# EAGLE design minionRVB (EAGLE 7.2.0)
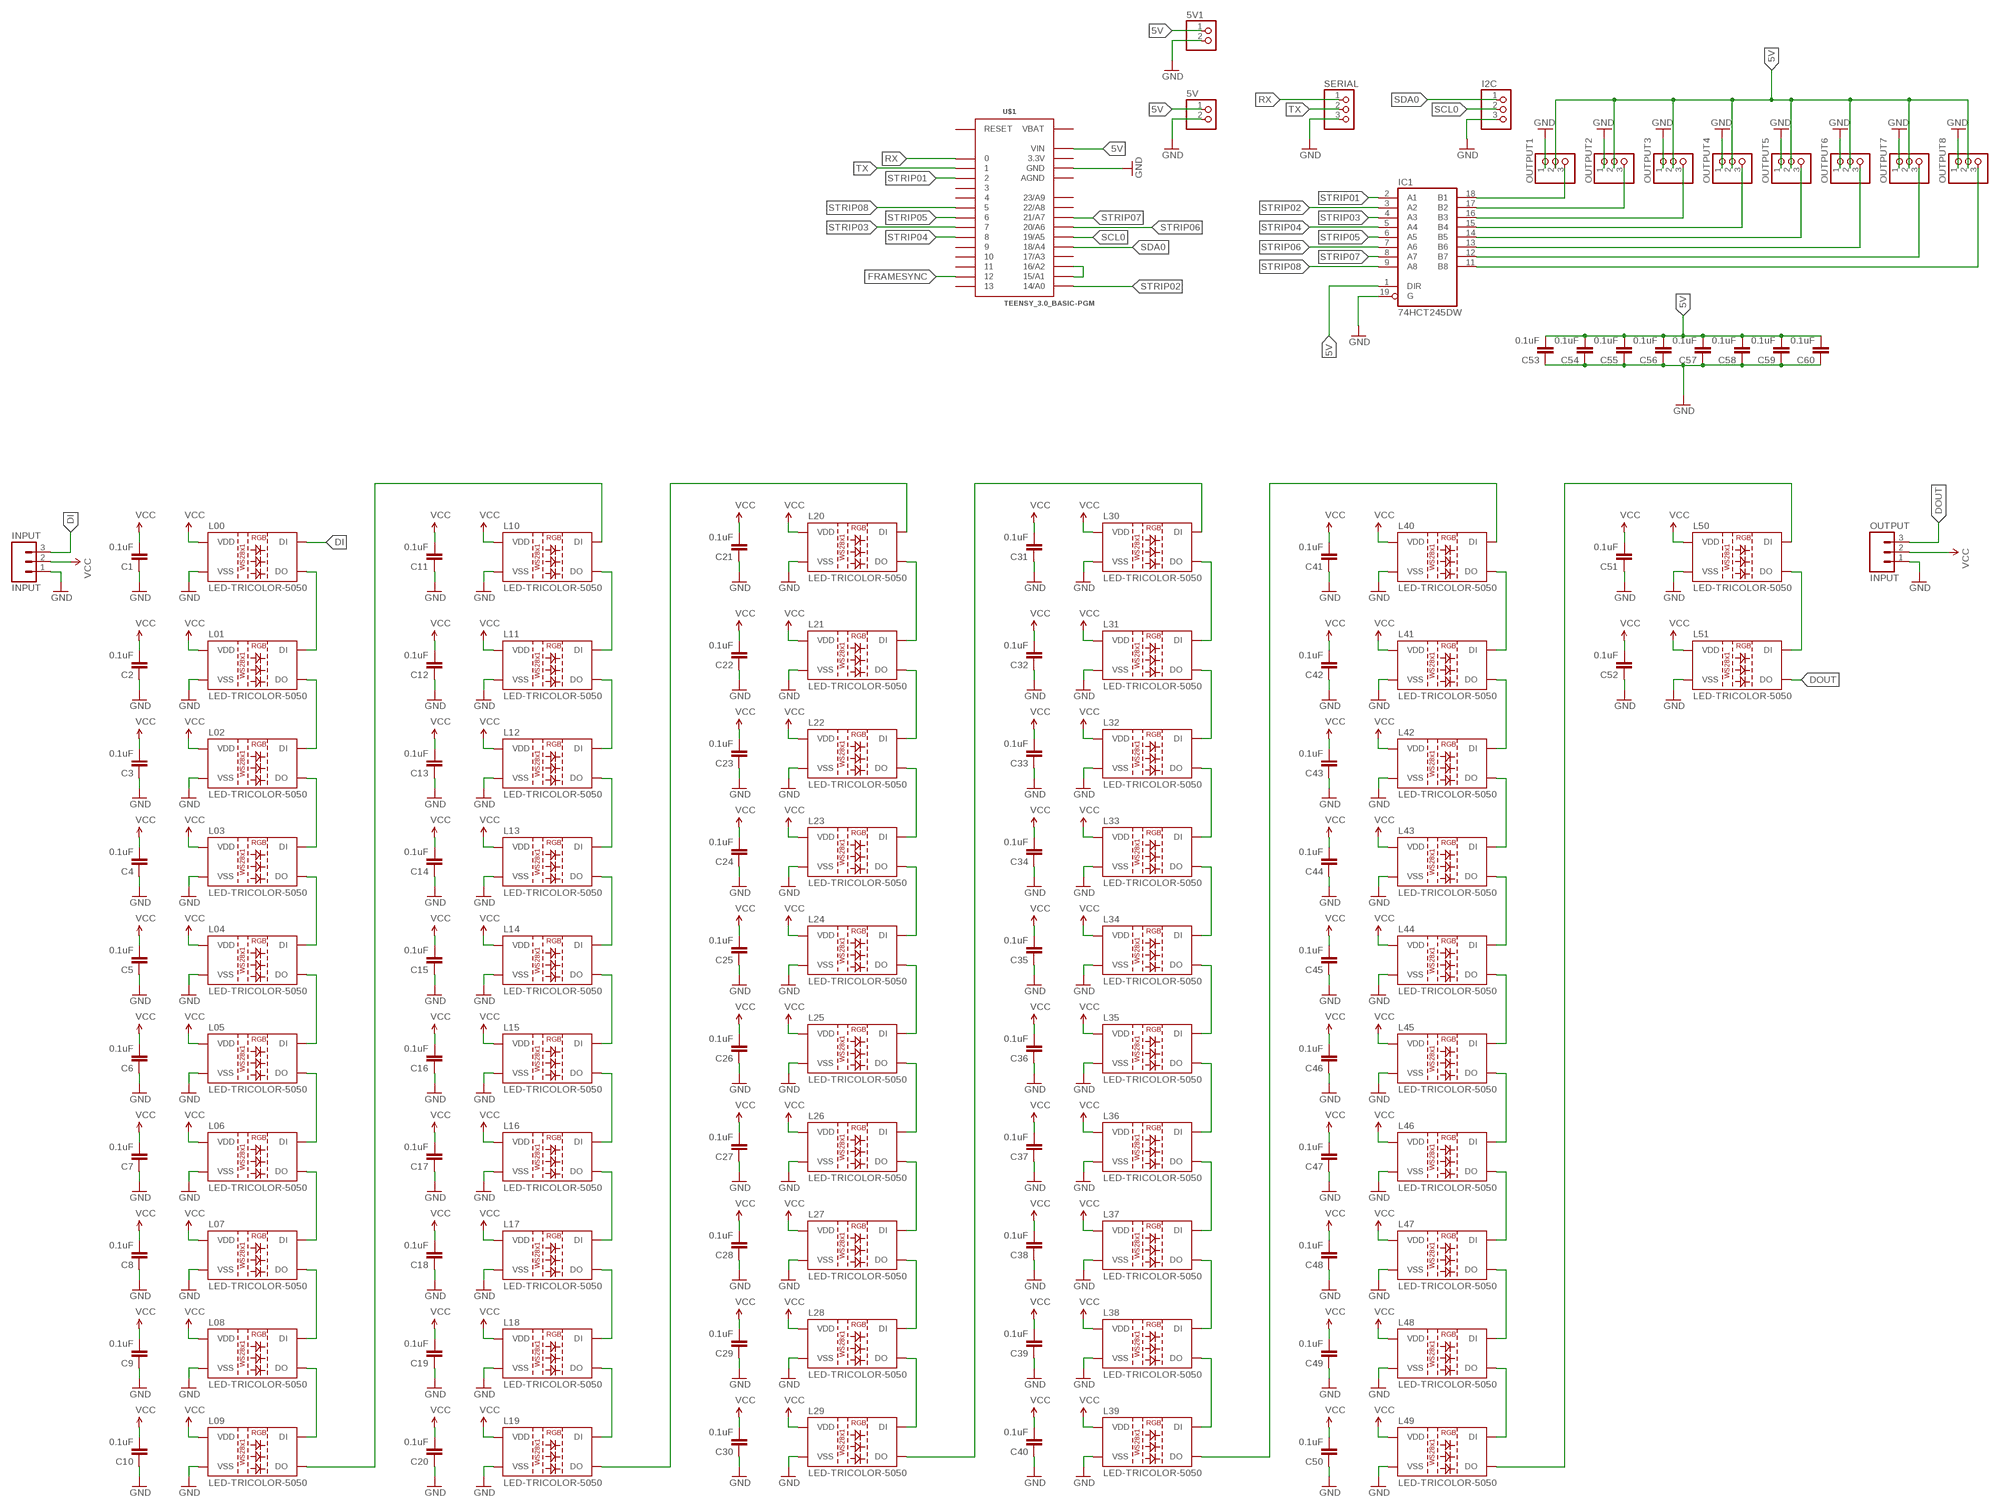
[diagram p0: schematic, sheet 1]

## Parts
5V  PINHD-1X2  [1X02]
5V1  PINHD-1X2  [1X02]
C1  0.1uF  CAP0603-CAP  [0603-CAP]
C2  0.1uF  CAP0603-CAP  [0603-CAP]
C3  0.1uF  CAP0603-CAP  [0603-CAP]
C4  0.1uF  CAP0603-CAP  [0603-CAP]
C5  0.1uF  CAP0603-CAP  [0603-CAP]
C6  0.1uF  CAP0603-CAP  [0603-CAP]
C7  0.1uF  CAP0603-CAP  [0603-CAP]
C8  0.1uF  CAP0603-CAP  [0603-CAP]
C9  0.1uF  CAP0603-CAP  [0603-CAP]
C10  0.1uF  CAP0603-CAP  [0603-CAP]
C11  0.1uF  CAP0603-CAP  [0603-CAP]
C12  0.1uF  CAP0603-CAP  [0603-CAP]
C13  0.1uF  CAP0603-CAP  [0603-CAP]
C14  0.1uF  CAP0603-CAP  [0603-CAP]
C15  0.1uF  CAP0603-CAP  [0603-CAP]
C16  0.1uF  CAP0603-CAP  [0603-CAP]
C17  0.1uF  CAP0603-CAP  [0603-CAP]
C18  0.1uF  CAP0603-CAP  [0603-CAP]
C19  0.1uF  CAP0603-CAP  [0603-CAP]
C20  0.1uF  CAP0603-CAP  [0603-CAP]
C21  0.1uF  CAP0603-CAP  [0603-CAP]
C22  0.1uF  CAP0603-CAP  [0603-CAP]
C23  0.1uF  CAP0603-CAP  [0603-CAP]
C24  0.1uF  CAP0603-CAP  [0603-CAP]
C25  0.1uF  CAP0603-CAP  [0603-CAP]
C26  0.1uF  CAP0603-CAP  [0603-CAP]
C27  0.1uF  CAP0603-CAP  [0603-CAP]
C28  0.1uF  CAP0603-CAP  [0603-CAP]
C29  0.1uF  CAP0603-CAP  [0603-CAP]
C30  0.1uF  CAP0603-CAP  [0603-CAP]
C31  0.1uF  CAP0603-CAP  [0603-CAP]
C32  0.1uF  CAP0603-CAP  [0603-CAP]
C33  0.1uF  CAP0603-CAP  [0603-CAP]
C34  0.1uF  CAP0603-CAP  [0603-CAP]
C35  0.1uF  CAP0603-CAP  [0603-CAP]
C36  0.1uF  CAP0603-CAP  [0603-CAP]
C37  0.1uF  CAP0603-CAP  [0603-CAP]
C38  0.1uF  CAP0603-CAP  [0603-CAP]
C39  0.1uF  CAP0603-CAP  [0603-CAP]
C40  0.1uF  CAP0603-CAP  [0603-CAP]
C41  0.1uF  CAP0603-CAP  [0603-CAP]
C42  0.1uF  CAP0603-CAP  [0603-CAP]
C43  0.1uF  CAP0603-CAP  [0603-CAP]
C44  0.1uF  CAP0603-CAP  [0603-CAP]
C45  0.1uF  CAP0603-CAP  [0603-CAP]
C46  0.1uF  CAP0603-CAP  [0603-CAP]
C47  0.1uF  CAP0603-CAP  [0603-CAP]
C48  0.1uF  CAP0603-CAP  [0603-CAP]
C49  0.1uF  CAP0603-CAP  [0603-CAP]
C50  0.1uF  CAP0603-CAP  [0603-CAP]
C51  0.1uF  CAP0603-CAP  [0603-CAP]
C52  0.1uF  CAP0603-CAP  [0603-CAP]
C53  0.1uF  CAP0603-CAP  [0603-CAP]
C54  0.1uF  CAP0603-CAP  [0603-CAP]
C55  0.1uF  CAP0603-CAP  [0603-CAP]
C56  0.1uF  CAP0603-CAP  [0603-CAP]
C57  0.1uF  CAP0603-CAP  [0603-CAP]
C58  0.1uF  CAP0603-CAP  [0603-CAP]
C59  0.1uF  CAP0603-CAP  [0603-CAP]
C60  0.1uF  CAP0603-CAP  [0603-CAP]
I2C  PINHD-1X3  [1X03]
IC1  74HCT245DW  [SO20W]
INPUT  INPUT  M03PTH  [1X03]
L00  LED-TRICOLOR-5050  LED-TRICOLOR-5050-ICWS2811  [LED-TRICOLOR-5050-IC]
L01  LED-TRICOLOR-5050  LED-TRICOLOR-5050-ICWS2811  [LED-TRICOLOR-5050-IC]
L02  LED-TRICOLOR-5050  LED-TRICOLOR-5050-ICWS2811  [LED-TRICOLOR-5050-IC]
L03  LED-TRICOLOR-5050  LED-TRICOLOR-5050-ICWS2811  [LED-TRICOLOR-5050-IC]
L04  LED-TRICOLOR-5050  LED-TRICOLOR-5050-ICWS2811  [LED-TRICOLOR-5050-IC]
L05  LED-TRICOLOR-5050  LED-TRICOLOR-5050-ICWS2811  [LED-TRICOLOR-5050-IC]
L06  LED-TRICOLOR-5050  LED-TRICOLOR-5050-ICWS2811  [LED-TRICOLOR-5050-IC]
L07  LED-TRICOLOR-5050  LED-TRICOLOR-5050-ICWS2811  [LED-TRICOLOR-5050-IC]
L08  LED-TRICOLOR-5050  LED-TRICOLOR-5050-ICWS2811  [LED-TRICOLOR-5050-IC]
L09  LED-TRICOLOR-5050  LED-TRICOLOR-5050-ICWS2811  [LED-TRICOLOR-5050-IC]
L10  LED-TRICOLOR-5050  LED-TRICOLOR-5050-ICWS2811  [LED-TRICOLOR-5050-IC]
L11  LED-TRICOLOR-5050  LED-TRICOLOR-5050-ICWS2811  [LED-TRICOLOR-5050-IC]
L12  LED-TRICOLOR-5050  LED-TRICOLOR-5050-ICWS2811  [LED-TRICOLOR-5050-IC]
L13  LED-TRICOLOR-5050  LED-TRICOLOR-5050-ICWS2811  [LED-TRICOLOR-5050-IC]
L14  LED-TRICOLOR-5050  LED-TRICOLOR-5050-ICWS2811  [LED-TRICOLOR-5050-IC]
L15  LED-TRICOLOR-5050  LED-TRICOLOR-5050-ICWS2811  [LED-TRICOLOR-5050-IC]
L16  LED-TRICOLOR-5050  LED-TRICOLOR-5050-ICWS2811  [LED-TRICOLOR-5050-IC]
L17  LED-TRICOLOR-5050  LED-TRICOLOR-5050-ICWS2811  [LED-TRICOLOR-5050-IC]
L18  LED-TRICOLOR-5050  LED-TRICOLOR-5050-ICWS2811  [LED-TRICOLOR-5050-IC]
L19  LED-TRICOLOR-5050  LED-TRICOLOR-5050-ICWS2811  [LED-TRICOLOR-5050-IC]
L20  LED-TRICOLOR-5050  LED-TRICOLOR-5050-ICWS2811  [LED-TRICOLOR-5050-IC]
L21  LED-TRICOLOR-5050  LED-TRICOLOR-5050-ICWS2811  [LED-TRICOLOR-5050-IC]
L22  LED-TRICOLOR-5050  LED-TRICOLOR-5050-ICWS2811  [LED-TRICOLOR-5050-IC]
L23  LED-TRICOLOR-5050  LED-TRICOLOR-5050-ICWS2811  [LED-TRICOLOR-5050-IC]
L24  LED-TRICOLOR-5050  LED-TRICOLOR-5050-ICWS2811  [LED-TRICOLOR-5050-IC]
L25  LED-TRICOLOR-5050  LED-TRICOLOR-5050-ICWS2811  [LED-TRICOLOR-5050-IC]
L26  LED-TRICOLOR-5050  LED-TRICOLOR-5050-ICWS2811  [LED-TRICOLOR-5050-IC]
L27  LED-TRICOLOR-5050  LED-TRICOLOR-5050-ICWS2811  [LED-TRICOLOR-5050-IC]
L28  LED-TRICOLOR-5050  LED-TRICOLOR-5050-ICWS2811  [LED-TRICOLOR-5050-IC]
L29  LED-TRICOLOR-5050  LED-TRICOLOR-5050-ICWS2811  [LED-TRICOLOR-5050-IC]
L30  LED-TRICOLOR-5050  LED-TRICOLOR-5050-ICWS2811  [LED-TRICOLOR-5050-IC]
L31  LED-TRICOLOR-5050  LED-TRICOLOR-5050-ICWS2811  [LED-TRICOLOR-5050-IC]
L32  LED-TRICOLOR-5050  LED-TRICOLOR-5050-ICWS2811  [LED-TRICOLOR-5050-IC]
L33  LED-TRICOLOR-5050  LED-TRICOLOR-5050-ICWS2811  [LED-TRICOLOR-5050-IC]
L34  LED-TRICOLOR-5050  LED-TRICOLOR-5050-ICWS2811  [LED-TRICOLOR-5050-IC]
L35  LED-TRICOLOR-5050  LED-TRICOLOR-5050-ICWS2811  [LED-TRICOLOR-5050-IC]
L36  LED-TRICOLOR-5050  LED-TRICOLOR-5050-ICWS2811  [LED-TRICOLOR-5050-IC]
L37  LED-TRICOLOR-5050  LED-TRICOLOR-5050-ICWS2811  [LED-TRICOLOR-5050-IC]
L38  LED-TRICOLOR-5050  LED-TRICOLOR-5050-ICWS2811  [LED-TRICOLOR-5050-IC]
L39  LED-TRICOLOR-5050  LED-TRICOLOR-5050-ICWS2811  [LED-TRICOLOR-5050-IC]
L40  LED-TRICOLOR-5050  LED-TRICOLOR-5050-ICWS2811  [LED-TRICOLOR-5050-IC]
L41  LED-TRICOLOR-5050  LED-TRICOLOR-5050-ICWS2811  [LED-TRICOLOR-5050-IC]
L42  LED-TRICOLOR-5050  LED-TRICOLOR-5050-ICWS2811  [LED-TRICOLOR-5050-IC]
L43  LED-TRICOLOR-5050  LED-TRICOLOR-5050-ICWS2811  [LED-TRICOLOR-5050-IC]
L44  LED-TRICOLOR-5050  LED-TRICOLOR-5050-ICWS2811  [LED-TRICOLOR-5050-IC]
L45  LED-TRICOLOR-5050  LED-TRICOLOR-5050-ICWS2811  [LED-TRICOLOR-5050-IC]
L46  LED-TRICOLOR-5050  LED-TRICOLOR-5050-ICWS2811  [LED-TRICOLOR-5050-IC]
L47  LED-TRICOLOR-5050  LED-TRICOLOR-5050-ICWS2811  [LED-TRICOLOR-5050-IC]
L48  LED-TRICOLOR-5050  LED-TRICOLOR-5050-ICWS2811  [LED-TRICOLOR-5050-IC]
L49  LED-TRICOLOR-5050  LED-TRICOLOR-5050-ICWS2811  [LED-TRICOLOR-5050-IC]
L50  LED-TRICOLOR-5050  LED-TRICOLOR-5050-ICWS2811  [LED-TRICOLOR-5050-IC]
L51  LED-TRICOLOR-5050  LED-TRICOLOR-5050-ICWS2811  [LED-TRICOLOR-5050-IC]
OUTPUT  INPUT  M03PTH  [1X03]
OUTPUT1  PINHD-1X3  [1X03]
OUTPUT2  PINHD-1X3  [1X03]
OUTPUT3  PINHD-1X3  [1X03]
OUTPUT4  PINHD-1X3  [1X03]
OUTPUT5  PINHD-1X3  [1X03]
OUTPUT6  PINHD-1X3  [1X03]
OUTPUT7  PINHD-1X3  [1X03]
OUTPUT8  PINHD-1X3  [1X03]
SERIAL  PINHD-1X3  [1X03]
U$1  TEENSY_3.0_BASIC-PGM  [TEENSY_3.0_BASIC-PGM]

## Nets
5V: 5V1.1 5V.1 C53.2 C54.2 C55.2 C56.2 C57.2 C58.2 C59.2 C60.2 IC1.1(DIR) OUTPUT1.2 OUTPUT2.2 OUTPUT3.2 OUTPUT4.2 OUTPUT5.2 OUTPUT6.2 OUTPUT7.2 OUTPUT8.2 U$1.VIN
DI: INPUT.3 L00.2(DI)
DOUT: L51.1(DO) OUTPUT.3
FRAMESYNC: U$1.12
GND: 5V1.2 5V.2 C1.1 C2.1 C3.1 C4.1 C5.1 C6.1 C7.1 C8.1 C9.1 C10.1 C11.1 C12.1 C13.1 C14.1 C15.1 C16.1 C17.1 C18.1 C19.1 C20.1 C21.1 C22.1 C23.1 C24.1 C25.1 C26.1 C27.1 C28.1 C29.1 C30.1 C31.1 C32.1 C33.1 C34.1 C35.1 C36.1 C37.1 C38.1 C39.1 C40.1 C41.1 C42.1 C43.1 C44.1 C45.1 C46.1 C47.1 C48.1 C49.1 C50.1 C51.1 C52.1 C53.1 C54.1 C55.1 C56.1 C57.1 C58.1 C59.1 C60.1 I2C.3 IC1.19(G) INPUT.1 L00.6(VSS) L01.6(VSS) L02.6(VSS) L03.6(VSS) L04.6(VSS) L05.6(VSS) L06.6(VSS) L07.6(VSS) L08.6(VSS) L09.6(VSS) L10.6(VSS) L11.6(VSS) L12.6(VSS) L13.6(VSS) L14.6(VSS) L15.6(VSS) L16.6(VSS) L17.6(VSS) L18.6(VSS) L19.6(VSS) L20.6(VSS) L21.6(VSS) L22.6(VSS) L23.6(VSS) L24.6(VSS) L25.6(VSS) L26.6(VSS) L27.6(VSS) L28.6(VSS) L29.6(VSS) L30.6(VSS) L31.6(VSS) L32.6(VSS) L33.6(VSS) L34.6(VSS) L35.6(VSS) L36.6(VSS) L37.6(VSS) L38.6(VSS) L39.6(VSS) L40.6(VSS) L41.6(VSS) L42.6(VSS) L43.6(VSS) L44.6(VSS) L45.6(VSS) L46.6(VSS) L47.6(VSS) L48.6(VSS) L49.6(VSS) L50.6(VSS) L51.6(VSS) OUTPUT1.1 OUTPUT2.1 OUTPUT3.1 OUTPUT4.1 OUTPUT5.1 OUTPUT6.1 OUTPUT7.1 OUTPUT8.1 OUTPUT.1 SERIAL.3 U$1.GND U$1.GND1(GND)
N$1: U$1.15/A1 U$1.16/A2
N$2: L31.1(DO) L32.2(DI)
N$3: L33.1(DO) L34.2(DI)
N$4: L35.1(DO) L36.2(DI)
N$5: L01.1(DO) L02.2(DI)
N$6: L03.1(DO) L04.2(DI)
N$7: L05.1(DO) L06.2(DI)
N$8: L07.1(DO) L08.2(DI)
N$9: L08.1(DO) L09.2(DI)
N$10: L00.1(DO) L01.2(DI)
N$11: L02.1(DO) L03.2(DI)
N$12: L04.1(DO) L05.2(DI)
N$13: L06.1(DO) L07.2(DI)
N$14: L09.1(DO) L10.2(DI)
N$15: L11.1(DO) L12.2(DI)
N$16: L13.1(DO) L14.2(DI)
N$17: L15.1(DO) L16.2(DI)
N$18: L17.1(DO) L18.2(DI)
N$19: L18.1(DO) L19.2(DI)
N$20: L10.1(DO) L11.2(DI)
N$21: L12.1(DO) L13.2(DI)
N$22: L14.1(DO) L15.2(DI)
N$23: L16.1(DO) L17.2(DI)
N$24: L19.1(DO) L20.2(DI)
N$25: L21.1(DO) L22.2(DI)
N$26: L23.1(DO) L24.2(DI)
N$27: L25.1(DO) L26.2(DI)
N$28: L27.1(DO) L28.2(DI)
N$29: L28.1(DO) L29.2(DI)
N$30: L20.1(DO) L21.2(DI)
N$31: L22.1(DO) L23.2(DI)
N$32: L24.1(DO) L25.2(DI)
N$33: L26.1(DO) L27.2(DI)
N$34: L29.1(DO) L30.2(DI)
N$35: L37.1(DO) L38.2(DI)
N$36: L38.1(DO) L39.2(DI)
N$37: L30.1(DO) L31.2(DI)
N$38: L32.1(DO) L33.2(DI)
N$39: L34.1(DO) L35.2(DI)
N$40: L36.1(DO) L37.2(DI)
N$41: L39.1(DO) L40.2(DI)
N$42: IC1.18(B1) OUTPUT1.3
N$43: L41.1(DO) L42.2(DI)
N$44: L43.1(DO) L44.2(DI)
N$45: L45.1(DO) L46.2(DI)
N$46: L47.1(DO) L48.2(DI)
N$47: L48.1(DO) L49.2(DI)
N$48: L40.1(DO) L41.2(DI)
N$49: L42.1(DO) L43.2(DI)
N$50: L44.1(DO) L45.2(DI)
N$51: L46.1(DO) L47.2(DI)
N$52: L49.1(DO) L50.2(DI)
N$53: L50.1(DO) L51.2(DI)
N$54: IC1.17(B2) OUTPUT2.3
N$55: IC1.16(B3) OUTPUT3.3
N$56: IC1.15(B4) OUTPUT4.3
N$57: IC1.14(B5) OUTPUT5.3
N$58: IC1.13(B6) OUTPUT6.3
N$59: IC1.12(B7) OUTPUT7.3
N$60: IC1.11(B8) OUTPUT8.3
RX: SERIAL.1 U$1.0
SCL0: I2C.2 U$1.19/A5
SDA0: I2C.1 U$1.18/A4
STRIP01: IC1.2(A1) U$1.2
STRIP02: IC1.3(A2) U$1.14/A0
STRIP03: IC1.4(A3) U$1.7
STRIP04: IC1.5(A4) U$1.8
STRIP05: IC1.6(A5) U$1.6
STRIP06: IC1.7(A6) U$1.20/A6
STRIP07: IC1.8(A7) U$1.21/A7
STRIP08: IC1.9(A8) U$1.5
TX: SERIAL.2 U$1.1
VCC: C1.2 C2.2 C3.2 C4.2 C5.2 C6.2 C7.2 C8.2 C9.2 C10.2 C11.2 C12.2 C13.2 C14.2 C15.2 C16.2 C17.2 C18.2 C19.2 C20.2 C21.2 C22.2 C23.2 C24.2 C25.2 C26.2 C27.2 C28.2 C29.2 C30.2 C31.2 C32.2 C33.2 C34.2 C35.2 C36.2 C37.2 C38.2 C39.2 C40.2 C41.2 C42.2 C43.2 C44.2 C45.2 C46.2 C47.2 C48.2 C49.2 C50.2 C51.2 C52.2 INPUT.2 L00.3(VDD) L00.5(VDD) L01.3(VDD) L01.5(VDD) L02.3(VDD) L02.5(VDD) L03.3(VDD) L03.5(VDD) L04.3(VDD) L04.5(VDD) L05.3(VDD) L05.5(VDD) L06.3(VDD) L06.5(VDD) L07.3(VDD) L07.5(VDD) L08.3(VDD) L08.5(VDD) L09.3(VDD) L09.5(VDD) L10.3(VDD) L10.5(VDD) L11.3(VDD) L11.5(VDD) L12.3(VDD) L12.5(VDD) L13.3(VDD) L13.5(VDD) L14.3(VDD) L14.5(VDD) L15.3(VDD) L15.5(VDD) L16.3(VDD) L16.5(VDD) L17.3(VDD) L17.5(VDD) L18.3(VDD) L18.5(VDD) L19.3(VDD) L19.5(VDD) L20.3(VDD) L20.5(VDD) L21.3(VDD) L21.5(VDD) L22.3(VDD) L22.5(VDD) L23.3(VDD) L23.5(VDD) L24.3(VDD) L24.5(VDD) L25.3(VDD) L25.5(VDD) L26.3(VDD) L26.5(VDD) L27.3(VDD) L27.5(VDD) L28.3(VDD) L28.5(VDD) L29.3(VDD) L29.5(VDD) L30.3(VDD) L30.5(VDD) L31.3(VDD) L31.5(VDD) L32.3(VDD) L32.5(VDD) L33.3(VDD) L33.5(VDD) L34.3(VDD) L34.5(VDD) L35.3(VDD) L35.5(VDD) L36.3(VDD) L36.5(VDD) L37.3(VDD) L37.5(VDD) L38.3(VDD) L38.5(VDD) L39.3(VDD) L39.5(VDD) L40.3(VDD) L40.5(VDD) L41.3(VDD) L41.5(VDD) L42.3(VDD) L42.5(VDD) L43.3(VDD) L43.5(VDD) L44.3(VDD) L44.5(VDD) L45.3(VDD) L45.5(VDD) L46.3(VDD) L46.5(VDD) L47.3(VDD) L47.5(VDD) L48.3(VDD) L48.5(VDD) L49.3(VDD) L49.5(VDD) L50.3(VDD) L50.5(VDD) L51.3(VDD) L51.5(VDD) OUTPUT.2
Unconnected: U$1.3 U$1.4 U$1.9 U$1.10 U$1.11 U$1.13 U$1.17/A3 U$1.22/A8 U$1.23/A9 U$1.RESET

## Power pins joined to a net without a drawn wire
3.3V: U$1.3.3V U$1.3.3V1(3.3V)
AGND: U$1.AGND
GND: IC1.10(GND)
VBAT: U$1.VBAT
VCC: IC1.20(VCC)

## Library data of the parts
5V 5V1 = pinhead:PINHD-1X2: PIN HEADER
C1-C60 = SparkFun:CAP: Capacitor Standard 0603 ceramic capacitor, and 0.1" leaded capacitor.
I2C OUTPUT1-OUTPUT8 SERIAL = pinhead:PINHD-1X3: PIN HEADER
IC1 = 74xx-eu:74*245: Octal BUS TRANSCEIVER, 3-state
INPUT OUTPUT = SparkFun-Connectors:M03: Header 3 Standard 3-pin 0.1" header. Use with straight break away headers (SKU : PRT-00116), right angle break away headers (PRT-00553), swiss pins (PRT-00743), machine pins (PRT-00117), and female headers (PRT-00115). Molex polarized connector foot print use with SKU : PRT-08232 with associated crimp pins and housings.
L00 L01-L09 L10-L51 = SparkFun-LED:LED-TRICOLOR-5050-IC: 5x5mm SMD LED with built-in controller IC.
U$1 = Teensy3.0:TEENSY_3.0_BASIC-PGM: Teensy 3.0 Board outline identical to other 'basic' version except that 'PGM' pin has been omitted. See '+4', 'AllAnalogPins", and 'AllPins' packages for additional pin holes, as needed.

## Board
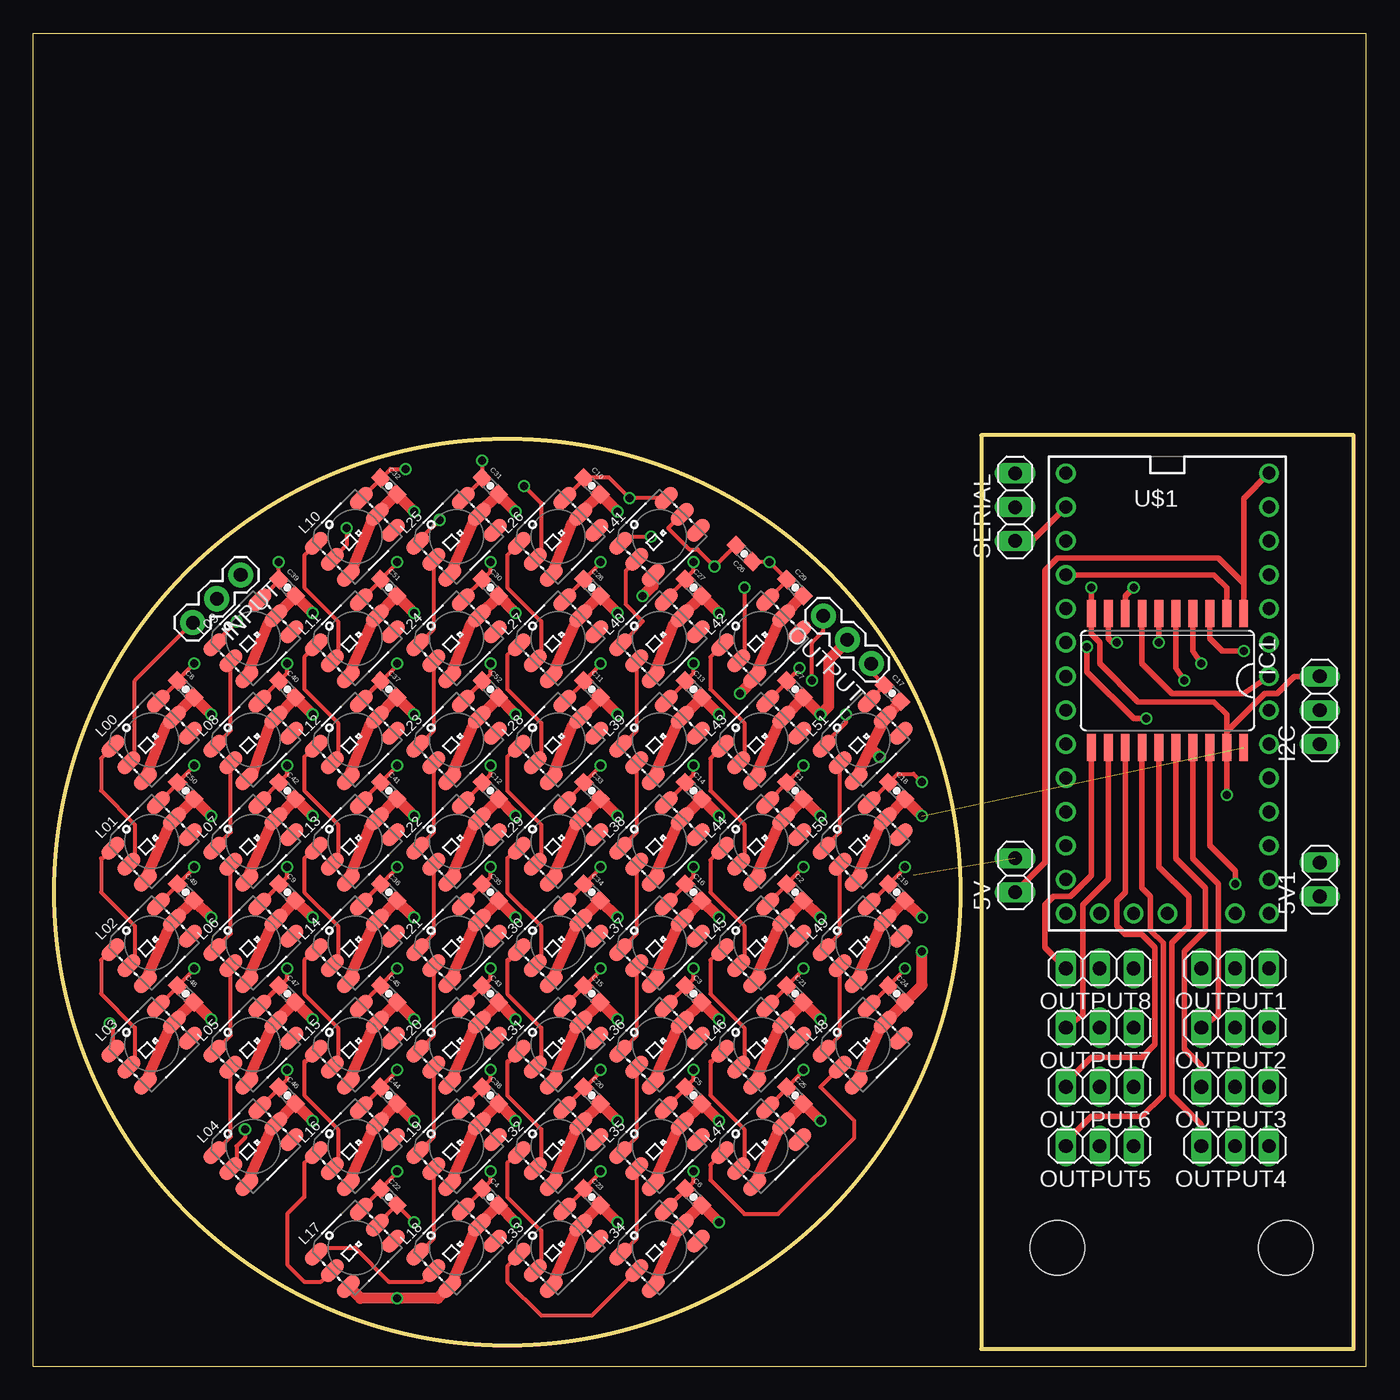
[diagram p1: board, top side]
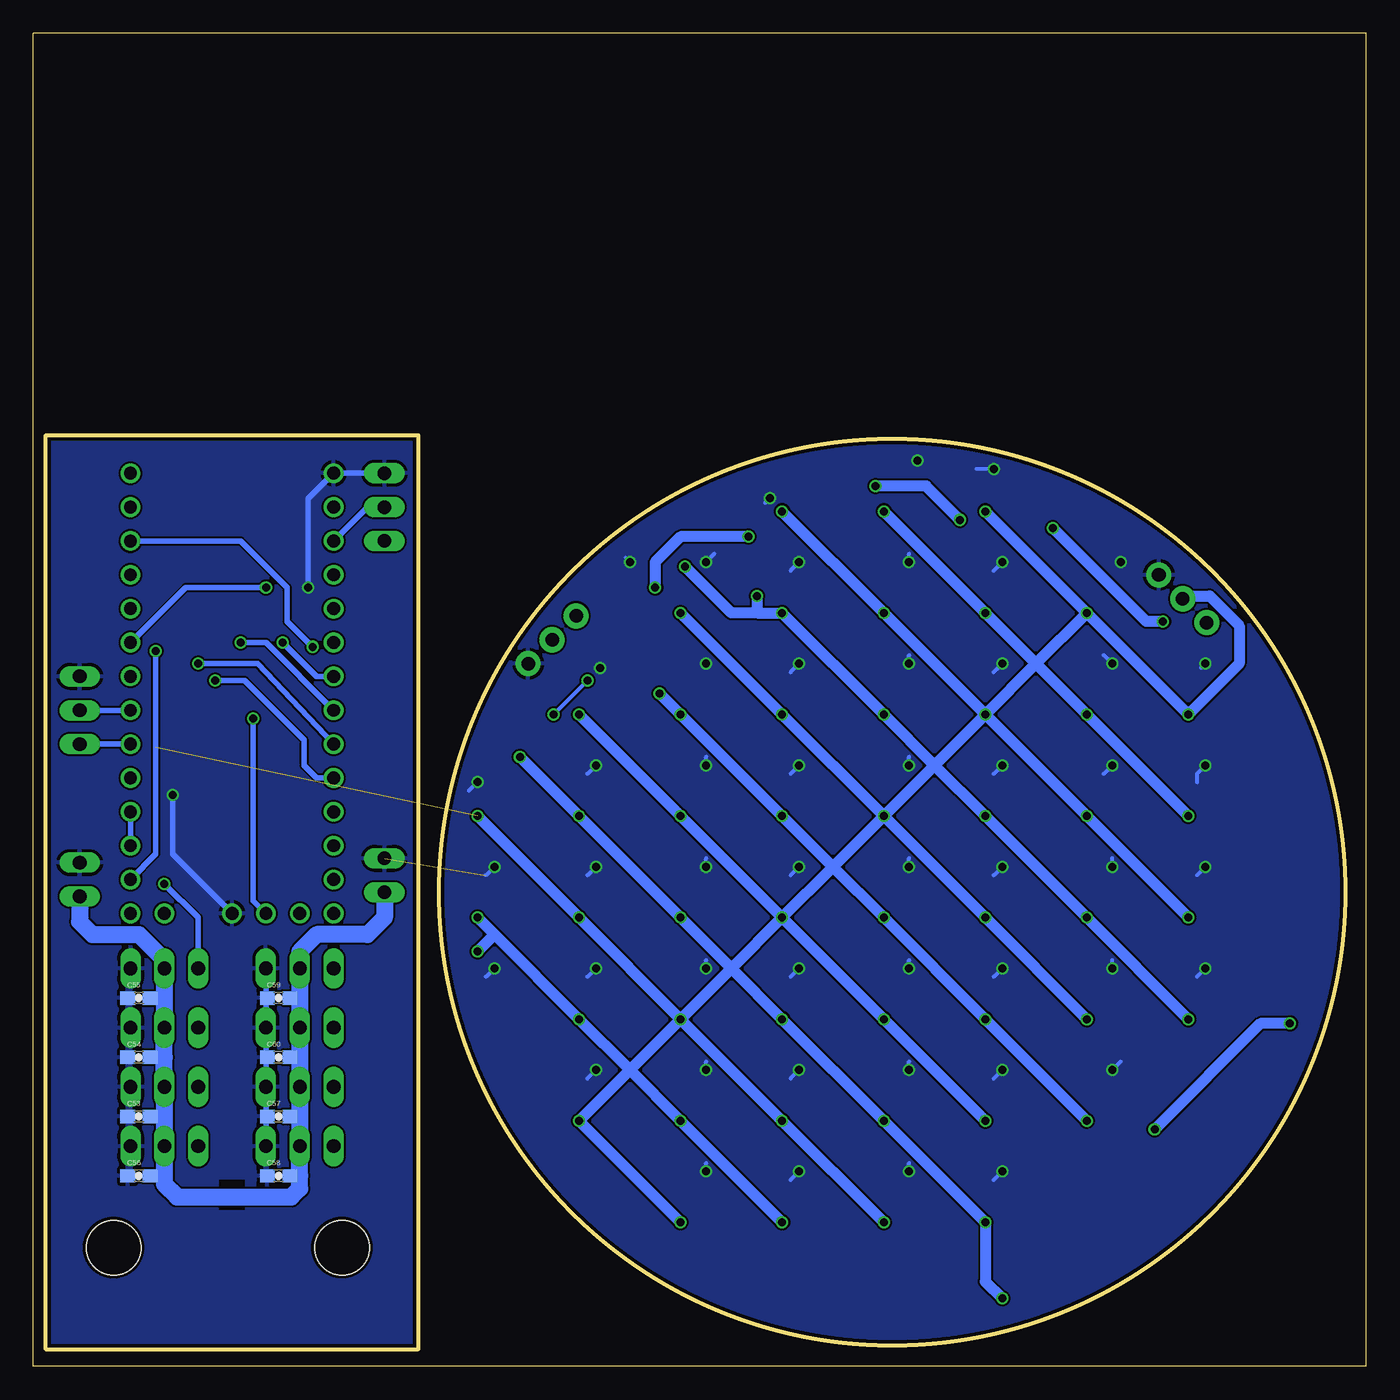
[diagram p2: board, bottom side, seen from below]

Size 100 x 100 mm. Coordinates in mm from the lower left corner, seen from the top.
Outline: 0,0 100,0 100,100 0,100 0,0
Outline: 99.06,69.85 71.12,69.85 71.12,1.27 99.06,1.27 99.06,69.85
Outline: circle at 35.56,35.56 radius 34
Copper layers (1*16): Top 0.035mm / dielectric 1.5mm / Bottom 0.035mm
Design rules "SeeedStudio_2layer_DRU_no_angle_20140221": minimum track width 6mil, minimum drill 12mil, track to track 6mil, track to pad 6mil, pad to pad 6mil, via to via 6mil, smd to smd 0mil, copper to edge 10mil, drill to drill 10mil, minimum pad ring 10mil, minimum via ring 6mil, stop-mask expansion 2mil, vias tented up to drill 100mil, thermal gap 10mil
Holes 4.1 mm at 93.98,8.89 76.83,8.89
bRestrict: area 84.1,11.7 to 86,14

### Footprints (pad centres in the part's own frame; a part is rotated, then mirrored left to right if it is on the bottom)
1X02 = drill 1.016 long: 1 -1.27,0; 2 1.27,0
0603-CAP = smd 1.1 x 1: 1 -0.85,0; 2 0.85,0
1X03 = drill 1.016 long: 1 -2.54,0; 2 0,0; 3 2.54,0
SO20W = smd 0.66 x 2.032: 1 -5.715,-5.029; 2 -4.445,-5.029; 3 -3.175,-5.029; 4 -1.905,-5.029; 5 -0.635,-5.029; 6 0.635,-5.029; 7 1.905,-5.029; 8 3.175,-5.029; 9 4.445,-5.029; 10 5.715,-5.029; 11 5.715,5.029; 12 4.445,5.029; 13 3.175,5.029; 14 1.905,5.029; 15 0.635,5.029; 16 -0.635,5.029; 17 -1.905,5.029; 18 -3.175,5.029; 19 -4.445,5.029; 20 -5.715,5.029
1X03' = drill 1.016 pad 1.88: 1 0,0; 2 2.54,0; 3 5.08,0
LED-TRICOLOR-5050-IC = smd 2 x 1.1: 1 -2.4,1.7; 2 -2.4,0; 3 -2.4,-1.7; 4 2.4,-1.7; 5 2.4,0; 6 2.4,1.7
TEENSY_3.0_BASIC-PGM = drill 0.965: 0 -7.62,13.97; 1 -7.62,11.43; 2 -7.62,8.89; 3 -7.62,6.35; 3.3V 7.62,11.43; 3.3V1 -2.54,-16.51; 4 -7.62,3.81; 5 -7.62,1.27; 6 -7.62,-1.27; 7 -7.62,-3.81; 8 -7.62,-6.35; 9 -7.62,-8.89; 10 -7.62,-11.43; 11 -7.62,-13.97; 12 -7.62,-16.51; 13 7.62,-16.51; 14/A0 7.62,-13.97; 15/A1 7.62,-11.43; 16/A2 7.62,-8.89; 17/A3 7.62,-6.35; 18/A4 7.62,-3.81; 19/A5 7.62,-1.27; 20/A6 7.62,1.27; 21/A7 7.62,3.81; 22/A8 7.62,6.35; 23/A9 7.62,8.89; AGND 7.62,13.97; GND -7.62,16.51; GND1 0,-16.51; RESET 5.08,-16.51; VBAT -5.08,-16.51; VIN 7.62,16.51

### Placement (x,y rotation side)
5V  73.66,36.83 90 top
5V1  96.52,36.51 90 top
C1  57.15,43.18 315 top
C2  57.15,35.56 315 top
C3  49.53,27.94 315 top
C4  34.29,12.7 315 top
C5  49.53,20.32 315 top
C6  49.53,12.7 315 top
C7  57.15,50.8 315 top
C8  11.43,50.8 315 top
C9  19.05,35.56 315 top
C10  41.91,66.04 315 top
C11  41.91,50.8 315 top
C12  34.29,43.18 315 top
C13  49.53,50.8 315 top
C14  49.53,43.18 315 top
C15  41.91,27.94 315 top
C16  49.53,35.56 315 top
C17  64.45,50.48 315 top
C18  64.77,43.18 315 top
C19  64.77,35.56 315 top
C20  41.91,20.32 315 top
C21  57.15,27.94 315 top
C22  26.67,12.7 315 top
C23  41.91,12.7 315 top
C24  64.77,27.94 315 top
C25  57.15,20.32 315 top
C26  53.34,60.96 135 top
C27  49.53,58.42 315 top
C28  41.91,58.42 315 top
C29  57.15,58.42 315 top
C30  34.29,58.42 315 top
C31  34.29,66.04 315 top
C32  26.67,66.04 315 top
C33  41.91,43.18 315 top
C34  41.91,35.56 315 top
C35  34.29,35.56 315 top
C36  26.67,35.56 315 top
C37  26.67,50.8 315 top
C38  34.29,20.32 315 top
C39  19.05,58.42 315 top
C40  19.05,50.8 315 top
C41  26.67,43.18 315 top
C42  19.05,43.18 315 top
C43  34.29,27.94 315 top
C44  26.67,20.32 315 top
C45  26.67,27.94 315 top
C46  19.05,20.32 315 top
C47  19.05,27.94 315 top
C48  11.43,27.94 315 top
C49  11.43,35.56 315 top
C50  11.43,43.18 315 top
C51  26.67,58.42 315 top
C52  34.29,50.8 315 top
C53  92.08,18.73 0 bottom
C54  92.08,23.18 0 bottom
C55  92.08,27.62 0 bottom
C56  92.08,14.29 0 bottom
C57  81.6,18.73 0 bottom
C58  81.6,14.29 0 bottom
C59  81.6,27.62 0 bottom
C60  81.6,23.18 0 bottom
I2C  96.52,49.21 90 top
IC1  85.09,51.44 180 top
INPUT  INPUT  [1X03']  15.56,59.37 225 top
L00  8.89,46.99 45 top
L01  8.89,39.37 45 top
L02  8.89,31.75 45 top
L03  8.89,24.13 45 top
L04  16.51,16.51 45 top
L05  16.51,24.13 45 top
L06  16.51,31.75 45 top
L07  16.51,39.37 45 top
L08  16.51,46.99 45 top
L09  16.51,54.61 45 top
L10  24.13,62.23 45 top
L11  24.13,54.61 45 top
L12  24.13,46.99 45 top
L13  24.13,39.37 45 top
L14  24.13,31.75 45 top
L15  24.13,24.13 45 top
L16  24.13,16.51 45 top
L17  24.13,8.89 45 top
L18  31.75,8.89 45 top
L19  31.75,16.51 45 top
L20  31.75,24.13 45 top
L21  31.75,31.75 45 top
L22  31.75,39.37 45 top
L23  31.75,46.99 45 top
L24  31.75,54.61 45 top
L25  31.75,62.23 45 top
L26  39.37,62.23 45 top
L27  39.37,54.61 45 top
L28  39.37,46.99 45 top
L29  39.37,39.37 45 top
L30  39.37,31.75 45 top
L31  39.37,24.13 45 top
L32  39.37,16.51 45 top
L33  39.37,8.89 45 top
L34  46.99,8.89 45 top
L35  46.99,16.51 45 top
L36  46.99,24.13 45 top
L37  46.99,31.75 45 top
L38  46.99,39.37 45 top
L39  46.99,46.99 45 top
L40  46.99,54.61 45 top
L41  46.99,62.23 45 top
L42  54.61,54.61 45 top
L43  54.61,46.99 45 top
L44  54.61,39.37 45 top
L45  54.61,31.75 45 top
L46  54.61,24.13 45 top
L47  54.61,16.51 45 top
L48  62.23,24.13 45 top
L49  62.23,31.75 45 top
L50  62.23,39.37 45 top
L51  62.23,46.99 45 top
OUTPUT  INPUT  [1X03']  62.87,52.7 135 top
OUTPUT1  90.17,29.84 180 top
OUTPUT2  90.17,25.4 180 top
OUTPUT3  90.17,20.95 180 top
OUTPUT4  90.17,16.51 180 top
OUTPUT5  80.01,16.51 180 top
OUTPUT6  80.01,20.95 180 top
OUTPUT7  80.01,25.4 180 top
OUTPUT8  80.01,29.84 180 top
SERIAL  73.66,64.45 90 top
U$1  85.09,50.48 0 top

### Tracks (layer width: path | path; a pad name or v marks a point on that pad's centre or on a via)
3.3V  (via drill 0.6)
  Top 0.406: v79.06,53.98 79.06,52.07 82.55,48.58 v83.5,48.58
  Bottom 0.406: U$1.3.3V 84.45,61.91 80.96,58.42 80.96,55.88 v79.06,53.98 | v83.5,48.58 83.5,34.92 U$1.3.3V1
5V
  Top 0.406: U$1.VIN 90.81,65.09 90.81,58.74 | IC1.1 90.81,58.74 | 90.81,58.74 88.9,60.64 76.83,60.64 75.88,59.69 75.88,37.78 5V.1
  Bottom 0.813: 90.17,30.48 OUTPUT1.2 | C58.2 80.01,14.29 | C57.2 80.01,18.73 | C60.2 80.01,23.18 | C59.2 80.01,27.62 | C56.2 90.17,14.29 | C53.2 90.17,18.73 | C54.2 90.17,23.18 | C55.2 90.17,27.62
  Bottom 1.27: 5V.1 73.66,33.66 74.93,32.38 78.74,32.38 80.01,31.11 OUTPUT8.2 80.01,27.62 OUTPUT7.2 80.01,23.18 OUTPUT6.2 80.01,18.73 OUTPUT5.2 80.01,14.29 80.01,13.34 80.64,12.7 89.22,12.7 90.17,13.65 90.17,14.29 OUTPUT4.2 90.17,18.73 OUTPUT3.2 90.17,23.18 OUTPUT2.2 90.17,27.62 OUTPUT1.2 | 5V1.1 96.52,33.34 95.57,32.38 92.08,32.38 90.17,30.48
DI
  Top 0.305: L00.2 7.62,45.72 7.62,51.44 INPUT.3
DOUT  (via drill 0.6)
  Top 0.305: L51.1 59.33,46.63 60.96,48.26 v60.96,48.9 | v58.42,51.44 58.42,54.29 59.27,55.15 OUTPUT.3
  Bottom 0.305: v60.96,48.9 v58.42,51.44
GND  (via drill 0.6)  (1 unrouted)
  Top 0.305: L00.6 10.79,51.3 10.79,51.44 | L09.6 18.45,58.95 C39.1 18.45,59.09 v18.41,60.33 | L01.6 10.83,43.71 C50.1 12.06,45.02 v12.06,45.09 | L02.6 10.83,36.09 C49.1 12.06,37.4 v12.06,37.47 | L03.6 10.83,28.47 C48.1 12.06,29.78 v12.06,29.84 | C9.1 18.45,36.09 L06.6 19.05,36.69 v19.05,37.47 | C47.1 17,27.1 L05.6 19.05,29.07 v19.05,29.84 | L04.6 18.45,20.85 C46.1 19.05,21.52 v19.05,22.23 | L15.6 24.77,27.17 24.77,27.3 26,28.54 | 26,28.54 C45.1 | L16.6 26.07,20.85 C44.1 27.3,22.16 v27.3,22.23 | L17.6 26.07,13.23 C22.1 27.3,14.54 v27.3,14.61 | L18.6 33.69,13.23 C4.1 34.29,13.9 v34.29,14.61 | L19.6 33.69,20.85 C38.1 34.29,21.52 v34.29,22.23 | C20.1 41.31,20.85 L32.6 42.55,22.09 v42.55,22.23 | L33.6 41.31,13.23 C23.1 42.55,14.54 v42.55,14.61 | C6.1 48.93,13.23 L34.6 49.53,13.83 v49.53,14.61 | L47.6 56.55,20.85 C25.1 57.78,22.16 v57.78,22.23 | L35.6 48.93,20.85 C5.1 49.53,21.52 v49.53,22.23 | C3.1 48.93,28.47 L36.6 49.53,29.07 v49.53,29.84 | L46.6 56.55,28.47 C21.1 57.78,29.78 v57.78,29.84 | L48.6 64.17,28.47 C24.1 65.41,29.78 v65.41,29.84 | L49.6 64.17,36.09 C19.1 65.41,37.4 v65.41,37.47 | 56.55,36.09 C2.1 | L37.6 48.93,36.09 C16.1 49.53,36.76 v49.53,37.47 | L38.6 48.93,43.71 C14.1 49.53,44.38 v49.53,45.09 | L29.6 41.31,43.71 C33.1 42.55,45.02 v42.55,45.09 | L30.6 41.31,36.09 C34.1 42.55,37.4 v42.55,37.47 | C15.1 41.31,28.47 L31.6 42.55,29.71 v42.55,29.84 | C43.1 33.69,28.47 L20.6 34.29,29.07 v34.29,29.84 | C35.1 33.69,36.09 L21.6 34.29,36.69 v34.29,37.47 | L22.6 33.69,43.71 C12.1 34.29,44.38 v34.29,45.09 | L28.6 41.31,51.33 C11.1 42.55,52.64 v42.55,52.7 | L39.6 48.93,51.33 C13.1 49.53,52 v49.53,52.7
  Top 0.305: L43.6 56.55,51.33 C7.1 57.15,52 v57.47,52.39 | L42.6 56.55,58.95 C29.1 v55.24,60.33 55.21,60.36 C26.1 | C27.1 48.9,58.99 | L40.6 47.48,57.58 48.9,58.99 | L51.6 62.9,50.06 C17.1 62.87,52.07 OUTPUT.1 | L50.6 64.17,43.71 C18.1 64.84,44.45 66.04,44.45 v66.67,43.81 | L44.6 55.1,42.34 C1.1 57.78,45.02 v57.78,45.09 | C32.1 26.07,66.57 L10.6 26.81,67.31 v27.94,67.31 | L25.6 33.69,66.57 C31.1 33.69,67.91 v33.66,67.94 | L26.6 41.31,66.57 C10.1 41.27,66.67 43.18,66.67 v44.73,65.13 L41.6 | C37.1 24.62,49.96 L12.6 27.3,52.57 v27.3,52.7 | L08.6 17,49.96 C40.1 19.05,52 v19.05,52.7 | C52.1 32.24,49.96 L23.6 34.29,51.93 v34.29,52.7 | L27.6 39.87,57.58 C28.1 42.55,60.26 v42.55,60.33 | L13.6 24.62,42.34 C41.1 27.3,45.02 v27.3,45.09 | L14.6 24.62,34.72 C36.1 27.3,37.4 v27.3,37.47 | L07.6 17,42.34 C42.1 19.05,44.38 v19.05,45.09 | 26,28.54 v27.3,29.84 | v34.29,60.33 34.29,59.62 C30.1 32.24,57.58 L24.6 | v27.3,60.33 27.3,60.26 C51.1 26.07,58.95 L11.6 | C2.1 56.55,36.23 v57.78,37.47 | L45.6 55.1,34.72 C2.1 | 48.9,58.99 48.9,59.05 49.53,59.69 v49.53,60.33 | 10.79,51.44 C8.1 | 10.79,51.44 v12.06,52.7
  Top 0.406: v79.38,58.42 IC1.10 79.38,54.93 80.01,54.29 80.01,52.7 82.87,49.85 88.58,49.85 89.53,48.9 IC1.19 | IC1.19 v89.53,42.86 | I2C.3 94.61,51.75 93.34,50.48 92.39,50.48 89.53,47.62 IC1.19
  Bottom 0.305: 55.56,60.64 v55.24,60.33 | v12.06,45.09 12.7,44.45 12.7,43.81 | v12.06,37.47 12.7,36.83 | v12.06,29.84 12.7,29.21 | v19.05,45.09 19.68,44.45 | v19.05,52.7 19.68,53.34 | v27.3,45.09 27.94,44.45 | v27.3,37.47 27.94,36.83 | v27.3,29.84 27.94,29.21 | v27.3,22.23 27.94,21.59 | v27.3,14.61 27.94,13.97 | v19.05,22.23 18.41,22.86 | v34.29,22.23 34.29,22.86 | v34.29,14.61 34.29,15.24 | v42.55,14.61 43.18,13.97 | v49.53,22.23 49.53,22.86 | v57.78,29.84 58.42,29.21 | v57.78,22.23 58.42,21.59 | v65.41,29.84 66.04,29.21 | v65.41,37.47 66.04,36.83 | v66.67,43.81 67.31,43.18 | v49.53,45.09 49.53,45.72 | v42.55,45.09 43.18,44.45 | v42.55,52.7 43.18,52.07 | v42.55,60.33 43.18,59.69 | v34.29,60.33 34.29,60.96 | v27.3,60.33 27.94,59.69 | v27.94,67.31 29.21,67.31 | v27.3,52.7 27.94,52.07 | v34.29,45.09 34.29,45.72 | v42.55,37.47 43.18,36.83 | v49.53,37.47 49.53,38.1 | v49.53,29.84 49.53,30.48 | v42.55,22.23 43.18,21.59 | v19.05,37.47 19.05,38.1 | v34.29,29.84 34.29,30.48 | v34.29,37.47 34.29,38.1 | v42.55,29.84 43.18,29.21 | v49.53,14.61 49.53,15.24 | v57.78,45.09 58.42,44.45 | v34.29,52.7 34.29,53.34 | v19.05,29.84 19.05,30.48 | v44.73,65.13 45.09,64.77 | v57.78,37.47 58.42,36.83 | v49.53,60.33 48.9,60.96 | v12.06,52.7 12.38,52.39
  Bottom 0.406: v79.38,58.42 79.38,65.09 U$1.GND SERIAL.3 | v89.53,42.86 89.53,38.42 U$1.GND1 | OUTPUT4.1 92.71,15.88 | OUTPUT5.1 OUTPUT6.1 OUTPUT7.1 OUTPUT8.1
  pour Bottom: 1.27,69.85 99.06,69.85 99.06,1.27 1.27,1.27
N$1
  Bottom 0.406: U$1.15/A1 U$1.16/A2
N$2
  Top 0.305: L31.1 35.7,22.86 35.56,22.86 35.56,20.32 38.1,17.78 38.1,15.24 L32.2
N$3
  Top 0.305: L33.1 35.56,7.48 35.56,6.35 38.1,3.81 41.91,3.81 L34.2
N$4
  Top 0.305: L35.1 45.29,17.22 L36.2
N$5
  Top 0.305: L01.1 5.22,38.1 5.08,38.1 5.08,35.56 7.62,33.02 7.62,30.48 L02.2
N$6  (via drill 0.6)
  Top 0.305: L03.1 5.99,25.44 v5.71,25.72 | v15.88,17.78 15.88,17.14 15.24,16.51 15.24,15.24 L04.2
  Bottom 0.813: v5.71,25.72 7.94,25.72 v15.88,17.78
N$7
  Top 0.305: L05.1 14.81,24.84 L06.2
N$8
  Top 0.305: L07.1 14.81,40.08 L08.2
N$9
  Top 0.305: L08.1 14.81,47.7 L09.2
N$10
  Top 0.305: L00.1 5.08,45.58 5.08,43.18 7.62,40.64 7.62,38.1 L01.2
N$11
  Top 0.305: L02.1 5.85,31.11 5.08,30.48 5.08,27.94 7.62,25.4 7.62,22.86 L03.2
N$12
  Top 0.305: L04.1 14.81,17.22 L05.2
N$13
  Top 0.305: L06.1 14.81,32.46 L07.2
N$14  (via drill 0.6)
  Top 0.305: L09.1 13.97,54.47 13.97,54.61 v15.24,55.88 | v23.5,62.87 23.5,61.59 L10.2
  Bottom 0.813: v15.24,55.88 16.51,55.88 v23.5,62.87
N$15
  Top 0.305: L11.1 20.32,53.2 20.32,50.8 22.86,48.26 22.86,45.72 L12.2
N$16
  Top 0.305: L13.1 21.09,38.73 20.32,38.1 20.32,35.56 22.86,33.02 22.86,30.48 L14.2
N$17
  Top 0.305: L15.1 20.46,22.86 20.32,22.86 20.32,20.32 22.86,17.78 22.86,15.24 L16.2
N$18
  Top 0.305: L17.1 21.73,8.89 24.13,8.89 26.67,6.35 29.21,6.35 L18.2
N$19
  Top 0.305: L18.1 30.05,9.6 L19.2
N$20
  Top 0.305: L10.1 20.32,60.82 20.32,58.42 22.86,55.88 22.86,53.34 L11.2
N$21
  Top 0.305: L12.1 21.09,46.35 20.32,45.72 20.32,43.18 22.86,40.64 22.86,38.1 L13.2
N$22
  Top 0.305: L14.1 21.09,31.11 20.32,30.48 20.32,27.94 22.86,25.4 22.86,22.86 L15.2
N$23
  Top 0.305: L16.1 21.09,15.88 20.32,15.24 20.32,12.7 19.05,11.43 19.05,7.62 20.32,6.35 21.59,6.35 L17.2
N$24
  Top 0.305: L19.1 30.05,17.22 L20.2
N$25
  Top 0.305: L21.1 30.05,32.46 L22.2
N$26
  Top 0.305: L23.1 30.05,47.7 L24.2
N$27  (via drill 0.6)
  Top 0.305: L25.1 29.21,62.09 29.21,62.23 v30.48,63.5 | v36.83,66.04 38.1,64.77 38.1,60.96 L26.2
  Bottom 0.813: v30.48,63.5 33.02,66.04 v36.83,66.04
N$28
  Top 0.305: L27.1 36.33,53.98 35.56,53.34 35.56,50.8 38.1,48.26 38.1,45.72 L28.2
N$29
  Top 0.305: L28.1 36.65,46.67 35.56,45.72 35.56,43.18 38.1,40.64 38.1,38.1 L29.2
N$30
  Top 0.305: L20.1 30.05,24.84 L21.2
N$31
  Top 0.305: L22.1 30.05,40.08 L23.2
N$32
  Top 0.305: L24.1 30.05,55.32 L25.2
N$33
  Top 0.305: L26.1 35.56,60.82 35.56,58.42 38.1,55.88 38.1,53.34 L27.2
N$34
  Top 0.305: L29.1 36.33,38.73 35.56,38.1 35.56,35.56 38.1,33.02 38.1,30.48 L30.2
N$35
  Top 0.305: L37.1 45.29,32.46 L38.2
N$36
  Top 0.305: L38.1 45.29,40.08 L39.2
N$37
  Top 0.305: L30.1 35.7,30.48 35.56,30.48 35.56,27.94 38.1,25.4 38.1,22.86 L31.2
N$38
  Top 0.305: L32.1 36.33,15.88 35.56,15.24 35.56,12.7 38.1,10.16 38.1,7.62 L33.2
N$39
  Top 0.305: L34.1 45.29,9.6 L35.2
N$40
  Top 0.305: L36.1 45.29,24.84 L37.2
N$41
  Top 0.305: L39.1 45.29,47.7 L40.2
N$42  (via drill 0.6)
  Top 0.406: IC1.18 88.27,39.05 90.17,37.15 v90.17,36.2
  Bottom 0.406: v90.17,36.2 87.63,33.66 OUTPUT1.3
N$43  (via drill 0.6)
  Top 0.305: L41.1 44.45,62.09 | 44.45,62.09 44.45,62.23 | L42.2 53.34,53.34 v53.34,58.42 | 44.45,62.09 44.59,62.23 v46.35,62.23
  Bottom 0.813: v46.35,62.23 51.44,62.23 53.34,60.33 v53.34,58.42
N$44
  Top 0.305: L43.1 50.8,45.58 50.8,43.18 53.34,40.64 53.34,38.1 L44.2
N$45
  Top 0.305: L45.1 51.57,31.11 50.8,30.48 50.8,27.94 53.34,25.4 53.34,22.86 L46.2
N$46
  Top 0.305: L47.1 50.8,15.1 50.8,13.97 53.34,11.43 55.88,11.43 61.59,17.14 61.59,18.41 59.05,20.95 L48.2
N$47
  Top 0.305: L48.1 60.53,24.84 L49.2
N$48
  Top 0.305: L40.1 44.66,54.68 45.72,55.88 44.45,57.15 44.45,59.69 L41.2
N$49
  Top 0.305: L42.1 50.8,53.2 50.8,50.8 53.34,48.26 53.34,45.72 L43.2
N$50
  Top 0.305: L44.1 50.8,37.96 50.8,35.56 53.34,33.02 53.34,30.48 L45.2
N$51
  Top 0.305: L46.1 50.94,22.86 50.8,22.86 50.8,20.32 53.34,17.78 53.34,15.24 L47.2
N$52
  Top 0.305: L49.1 60.53,32.46 L50.2
N$53
  Top 0.305: L50.1 60.53,40.08 L51.2
N$54
  Top 0.406: IC1.17 87,38.1 88.9,36.2 88.9,26.35 OUTPUT2.3
N$55
  Top 0.406: IC1.16 85.72,38.1 87.95,35.88 87.95,32.7 86.36,31.11 86.36,23.81 87.63,22.54 OUTPUT3.3
N$56
  Top 0.406: IC1.15 84.45,37.47 86.68,35.24 86.68,33.02 85.41,31.75 85.41,20.32 87.63,18.1 OUTPUT4.3
N$57
  Top 0.406: IC1.14 83.19,35.88 83.82,35.24 83.82,32.7 84.77,31.75 84.77,20.32 83.19,18.73 79.38,18.73 77.47,16.83 OUTPUT5.3
N$58
  Top 0.406: IC1.13 81.92,35.56 81.28,34.92 81.28,33.02 81.92,32.38 83.19,32.38 84.14,31.43 84.14,24.13 83.19,23.18 79.38,23.18 77.47,21.27 OUTPUT6.3
N$59
  Top 0.406: IC1.12 80.64,36.51 78.74,34.61 78.74,26.35 OUTPUT7.3
N$60
  Top 0.406: IC1.11 79.38,36.83 77.79,35.24 76.52,35.24 75.88,34.61 75.88,31.43 OUTPUT8.3
RX
  Top 0.406: SERIAL.1 74.93,61.91 U$1.0
SCL0
  Bottom 0.406: I2C.2 U$1.19/A5
SDA0
  Bottom 0.406: I2C.1 U$1.18/A4
STRIP01
  Top 0.406: IC1.2 89.53,58.42 88.58,59.37 U$1.2
STRIP02  (via drill 0.6)
  Top 0.406: IC1.3 88.27,54.61 89.22,53.66 v90.81,53.66
  Bottom 0.406: v90.81,53.66 90.81,38.42 U$1.14/A0
STRIP03  (via drill 0.6)
  Top 0.406: IC1.4 87,53.66 v87.63,52.7
  Bottom 0.406: v87.63,52.7 83.19,52.7 U$1.7
STRIP04  (via drill 0.6)
  Top 0.406: IC1.5 85.72,52.39 v86.36,51.44
  Bottom 0.406: v86.36,51.44 84.14,51.44 79.69,46.99 79.69,45.09 78.74,44.13 U$1.8
STRIP05  (via drill 0.6)
  Top 0.406: 84.45,56.52 IC1.6 v84.45,54.29
  Bottom 0.406: v84.45,54.29 82.55,54.29 U$1.6
STRIP06
  Top 0.406: IC1.7 83.19,52.7 85.41,50.48 90.81,50.48 U$1.20/A6
STRIP07  (via drill 0.6)
  Top 0.406: IC1.8 81.92,57.78 v82.55,58.42
  Bottom 0.406: v82.55,58.42 88.58,58.42 U$1.21/A7
STRIP08  (via drill 0.6)
  Top 0.406: IC1.9 80.64,54.61 80.96,54.29 v81.28,54.29
  Bottom 0.406: v81.28,54.29 78.74,51.75 U$1.5
TX
  Bottom 0.406: U$1.1 74.93,64.45 SERIAL.2
VCC  (via drill 0.6)  (1 unrouted)
  Top 0.305: L00.5 10.59,48.76 | C39.2 19.65,57.75 | L10.3 23.77,59.33 | L10.5 25.83,63.99 | L01.5 10.59,41.13 | C40.2 19.65,50.13 | 16.51,44.59 L08.3 | L11.5 25.83,56.38 | C31.2 34.89,65.37 34.96,65.37 | L02.5 10.59,33.52 | C42.2 19.65,42.51 | L12.5 25.83,48.76 | C30.2 34.89,57.75 | L26.5 41.07,63.99 | L03.5 10.59,25.89 | C9.2 19.65,34.89 | L13.5 25.83,41.13 | C52.2 34.89,50.13 | L27.5 41.07,56.38 | C26.2 52.64,61.59 52.7,61.59 v51.12,60.01 49.85,61.28 49.21,61.28 47.62,62.87 L41.5 | L05.5 18.21,25.89 | C36.2 27.27,34.89 | C12.2 34.89,42.51 | C11.2 42.51,50.13 | C27.2 50.13,57.75 | L04.5 18.21,18.27 | C45.2 27.27,27.27 | C35.2 34.89,34.89 | C33.2 42.51,42.51 | C13.2 50.13,50.13 | L42.5 56.31,56.38 | L16.5 25.83,18.27 | C43.2 34.89,27.27 | C34.2 42.51,34.89 | C14.2 50.13,42.51 | C7.2 57.75,50.13 | L17.5 25.83,10.65 C22.2 v28.57,10.79 | 33.45,18.27 L19.5 | C15.2 42.51,27.27 | C1.2 57.75,42.51 | L18.5 33.45,10.65 | C20.2 42.51,19.65 | C3.2 50.13,27.27 | C2.2 57.75,34.89 | C18.2 65.37,42.51 | L33.5 41.07,10.65 | C5.2 50.13,19.65 | C21.2 57.75,27.27 | C19.2 65.37,34.89 | L34.5 48.69,10.65 | C25.2 57.75,19.65 | 65.37,27.27 C24.2 65.41,27.3 | L13.3 23.64,36.34 | L25.5 33.45,63.99 | C50.2 12.03,42.51 | v20.95,56.52 | v36.2,56.52 | v20.95,33.66 | v36.2,48.9 | v28.57,33.66 | v36.2,41.27 | v43.81,48.9 | v51.44,56.52 | v28.57,26.04 | v36.2,33.66 | v43.81,41.27 | v51.44,48.9 | v36.2,26.04 | v43.81,33.66 | v51.44,41.27 | v43.81,26.04 | v36.2,10.79 | v43.81,18.41 | v51.44,26.04 | v59.05,33.66 | v66.67,41.27 | v51.44,18.41 | v59.05,26.04 | v66.67,33.66 | v59.05,18.41 | v28.57,56.52
  Top 0.813: 10.59,48.76 C8.2 v13.34,48.9 | v20.95,56.52 C39.2 | 19.65,57.75 L09.5 17.6,55.7 L09.3 | 23.77,59.33 25.4,63.5 L10.5 | 25.83,63.99 C32.2 v28.57,64.14 | L01.3 10.3,40.78 L01.5 12.03,42.51 | 19.65,50.13 L08.5 17.78,48.26 16.51,44.59 | L11.3 25.54,56.02 L11.5 | 25.83,56.38 C51.2 v28.57,56.52 | L25.3 33.16,63.64 L25.5 | L02.3 10.3,33.16 L02.5 | 10.59,33.52 C49.2 v13.34,33.66 | 19.65,42.51 L07.5 17.92,40.78 L07.3 | L12.3 25.22,48.08 L12.5 | 25.83,48.76 C37.2 v28.57,48.9 | v36.2,56.52 C30.2 | 34.89,57.75 L24.5 32.84,55.7 L24.3 | L26.3 40.46,63.32 L26.5 | 41.07,63.99 C10.2 v43.81,64.14 | L03.3 10.3,25.54 L03.5 | 10.59,25.89 C48.2 v13.34,26.04 | 19.65,34.89 L06.5 17.92,33.16 L06.3 | L13.5 25.22,40.46 L13.3 | 25.83,41.13 C41.2 v28.57,41.27 | v36.2,48.9 C52.2 | 34.89,50.13 L23.5 33.16,48.4 L23.3 | L27.3 40.78,56.02 L27.5 | 41.07,56.38 C28.2 v43.81,56.52 | L41.3 46.49,58.56 v45.72,57.78 | L05.3 17.92,25.54 L05.5 | 18.21,25.89 C47.2 v20.95,26.04 | v28.57,33.66 C36.2 | 27.27,34.89 L14.5 25.54,33.16 L14.3 | v36.2,41.27 C12.2 | 34.89,42.51 L22.5 33.16,40.78 L22.3 | v43.81,48.9 C11.2 | 42.51,50.13 L28.5 40.46,48.08 L28.3 | v51.44,56.52 C27.2 | 50.13,57.75 L40.5 48.08,55.7 L40.3 | L04.3 17.92,17.92 L04.5 | 18.21,18.27 C46.2 v20.95,18.41 | v28.57,26.04 C45.2 | 27.27,27.27 L15.5 25.54,25.54 L15.3 | v36.2,33.66 C35.2 | 34.89,34.89 L21.5 33.16,33.16 L21.3 | v43.81,41.27 C33.2 | 42.51,42.51 L29.5 40.78,40.78 L29.3 | v51.44,48.9 C13.2 | 50.13,50.13 L39.5 48.4,48.4 L39.3 | L42.5 56.02,56.02 L42.3 54.12,51.58 v53.02,50.48 | 56.31,56.38 C29.2 | L16.3 25.54,17.92 L16.5 | 25.83,18.27 C44.2 v28.57,18.41 | v36.2,26.04 C43.2 | 34.89,27.27 L20.5 33.16,25.54 L20.3 | v43.81,33.66 C34.2
  Top 0.813: 42.51,34.89 L30.5 40.78,33.16 L30.3 | v51.44,41.27 C14.2 | 50.13,42.51 L38.5 48.4,40.78 L38.3 | 57.75,50.13 L43.5 56.02,48.4 L43.3 | L17.3 24.55,5.08 v27.3,5.08 30.34,5.08 L18.3 33.16,10.3 L18.5 | v36.2,18.41 C38.2 33.45,18.27 | L19.3 33.16,17.92 L19.5 | v43.81,26.04 C15.2 | 42.51,27.27 L31.5 40.78,25.54 L31.3 | v51.44,33.66 C16.2 L37.5 48.4,33.16 L37.3 | 57.75,42.51 L44.5 56.02,40.78 L44.3 | 33.45,10.65 C4.2 v36.2,10.79 | v43.81,18.41 C20.2 | 42.51,19.65 L32.5 40.78,17.92 L32.3 | v51.44,26.04 C3.2 | 50.13,27.27 L36.5 48.4,25.54 L36.3 | v59.05,33.66 C2.2 | 57.75,34.89 L45.5 56.02,33.16 L45.3 | 65.37,42.51 L50.5 63.64,40.78 L50.3 | v66.67,41.27 C18.2 | L33.3 40.78,10.3 L33.5 | 41.07,10.65 C23.2 v43.81,10.79 | v51.44,18.41 C5.2 | 50.13,19.65 L35.5 48.4,17.92 L35.3 | v59.05,26.04 C21.2 | 57.75,27.27 L46.5 56.02,25.54 L46.3 | v66.67,33.66 C19.2 | 65.37,34.89 L49.5 63.64,33.16 L49.3 | L34.3 48.4,10.3 L34.5 | 48.69,10.65 C6.2 v51.44,10.79 | v59.05,18.41 C25.2 | 57.75,19.65 L47.5 56.02,17.92 L47.3 | 65.37,27.27 L48.5 63.64,25.54 L48.3 | L00.3 9.98,48.08 L00.5 | C50.2 v13.34,41.27 | C40.2 v20.95,48.9 | 34.96,65.37 v36.2,64.14 | 33.45,63.99 C31.2 | 65.41,27.3 66.67,28.57 v66.67,31.11 | L51.3 62.82,46.37 | 62.82,46.37 L51.5 C17.2 | v63.5,45.72 62.82,46.37 | OUTPUT.2 61.07,54.4 59.69,53.02 59.69,49.53 v59.05,48.9 | C42.2 v20.95,41.27 | v20.95,41.27 | v20.95,33.66 C9.2 | v59.05,41.27 C1.2 | v59.05,48.9 C7.2 v59.05,48.9 | v59.05,48.9
  Bottom 0.305: v51.44,48.9 | v59.05,33.66 | v59.05,33.66 | v51.44,48.9 | v36.2,48.9 | v28.57,33.66 | v36.2,41.27 | v43.81,48.9 | v28.57,26.04 | v36.2,33.66 | v43.81,41.27 | v36.2,26.04 | v43.81,33.66 | v51.44,41.27 | v43.81,18.41 | v51.44,26.04 | v51.44,18.41 | v59.05,26.04 | v59.05,18.41 | v36.2,56.52 | v20.95,33.66 | v28.57,48.9 | v20.95,56.52
  Bottom 0.813: v13.34,26.04 v20.95,33.66 v28.57,41.27 32.38,45.09 | 32.38,45.09 v36.2,48.9 v43.81,56.52 45.72,56.52 | 45.72,56.52 47.62,56.52 v51.12,60.01 | v45.72,57.78 45.72,56.52 | v20.95,26.04 v28.57,33.66 v36.2,41.27 | v36.2,41.27 v43.81,48.9 v51.44,56.52 | v20.95,18.41 v28.57,26.04 v36.2,33.66 40.01,37.47 | 40.01,37.47 v43.81,41.27 v51.44,48.9 v53.02,50.48 | v28.57,18.41 v36.2,26.04 v43.81,33.66 | v43.81,33.66 v51.44,41.27 v59.05,48.9 | v27.3,5.08 28.57,6.35 v28.57,10.79 v36.2,18.41 v43.81,26.04 47.62,29.84 | 47.62,29.84 v51.44,33.66 v59.05,41.27 v63.5,45.72 | v36.2,10.79 v43.81,18.41 v51.44,26.04 | v51.44,26.04 v59.05,33.66 v66.67,41.27 | v43.81,10.79 v51.44,18.41 55.24,22.23 | 55.24,22.23 v59.05,26.04 65.41,32.38 | 65.41,32.38 v66.67,33.66 | v51.44,10.79 v59.05,18.41 55.24,22.23 | v20.95,56.52 v13.34,48.9 9.53,52.7 9.53,55.56 11.75,57.78 13.55,57.78 INPUT.2 | 55.24,22.23 v51.44,26.04 | v51.44,26.04 47.62,29.84 | 47.62,29.84 v43.81,33.66 | v43.81,33.66 40.01,37.47 | 40.01,37.47 v36.2,41.27 | v36.2,41.27 32.38,45.09 | 32.38,45.09 v28.57,48.9 | v28.57,48.9 24.77,52.7 | 24.77,52.7 v20.95,56.52 | v13.34,41.27 v20.95,48.9 24.77,52.7 | 24.77,52.7 v28.57,56.52 v36.2,64.14 | v43.81,64.14 v36.2,56.52 v28.57,48.9 | v66.67,31.11 65.41,32.38 | v20.95,56.52 v28.57,64.14 | v28.57,48.9 v20.95,41.27 v13.34,33.66